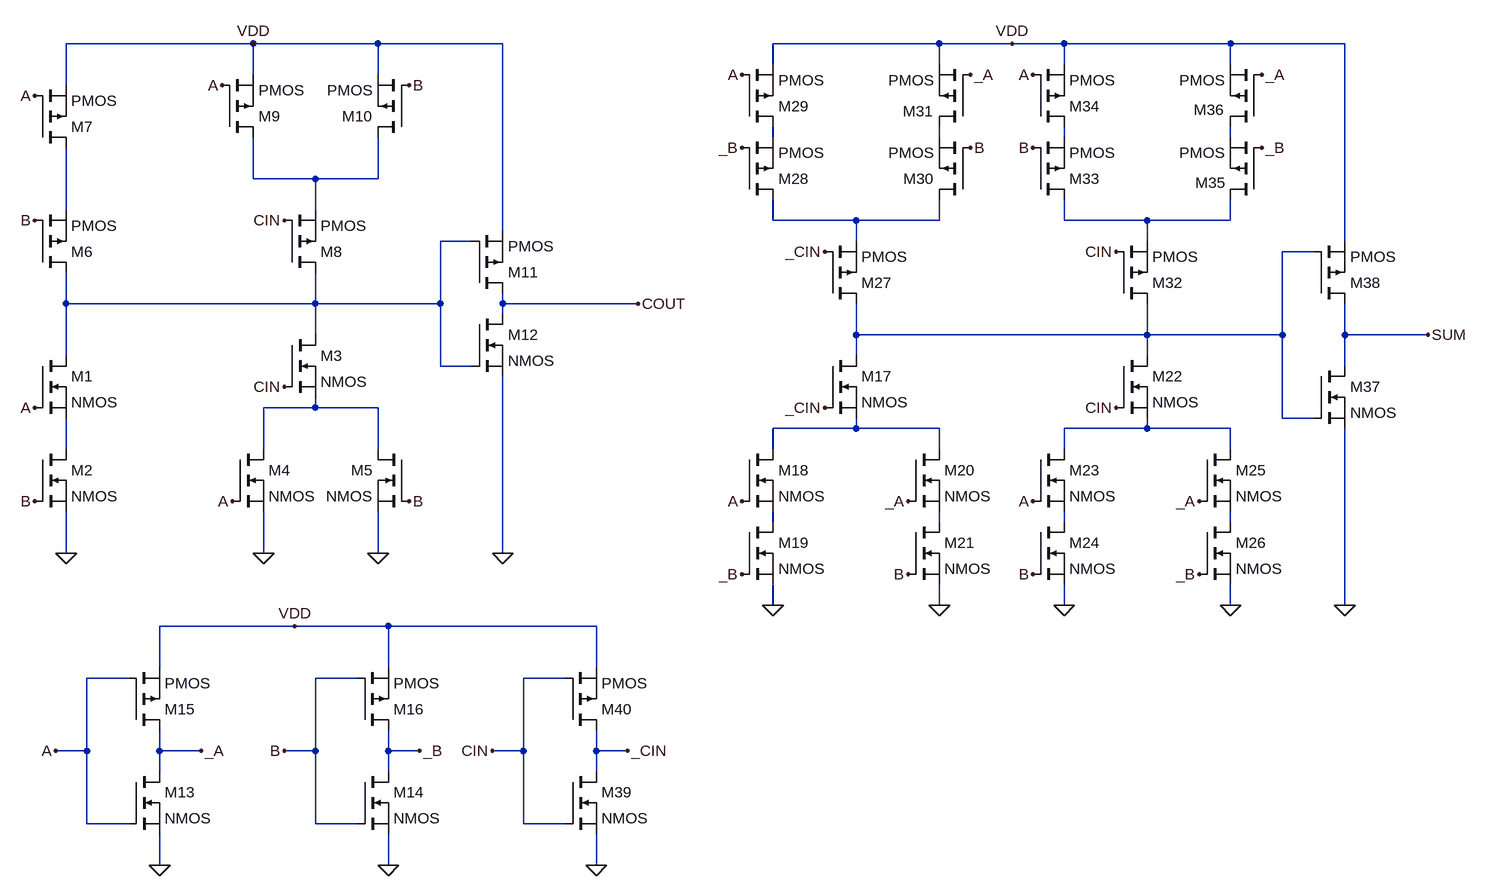
[diagram p0: schematic FA version1.asc]
FA version1.asc, the LTspice schematic file:
Version 4
SHEET 1 2888 1048
WIRE -64 -544 -352 -544
WIRE 128 -544 -64 -544
WIRE 320 -544 128 -544
WIRE 992 -544 736 -544
WIRE 1104 -544 992 -544
WIRE 1184 -544 1104 -544
WIRE 1440 -544 1184 -544
WIRE 1616 -544 1440 -544
WIRE 736 -512 736 -544
WIRE 992 -512 992 -544
WIRE 1184 -512 1184 -544
WIRE 1440 -512 1440 -544
WIRE -64 -496 -64 -544
WIRE 128 -496 128 -544
WIRE -352 -480 -352 -544
WIRE 736 -400 736 -416
WIRE 992 -400 992 -416
WIRE 1184 -400 1184 -416
WIRE 1440 -400 1440 -416
WIRE -64 -336 -64 -400
WIRE 32 -336 -64 -336
WIRE 128 -336 128 -400
WIRE 128 -336 32 -336
WIRE -352 -288 -352 -384
WIRE 32 -288 32 -336
WIRE 736 -272 736 -304
WIRE 864 -272 736 -272
WIRE 992 -272 992 -304
WIRE 992 -272 864 -272
WIRE 1184 -272 1184 -304
WIRE 1312 -272 1184 -272
WIRE 1440 -272 1440 -304
WIRE 1440 -272 1312 -272
WIRE 320 -256 320 -544
WIRE 272 -240 224 -240
WIRE 864 -240 864 -272
WIRE 1312 -240 1312 -272
WIRE 1616 -240 1616 -544
WIRE 1568 -224 1520 -224
WIRE -352 -144 -352 -192
WIRE 32 -144 32 -192
WIRE 32 -144 -352 -144
WIRE 224 -144 224 -240
WIRE 224 -144 32 -144
WIRE 320 -144 320 -160
WIRE 528 -144 320 -144
WIRE 320 -128 320 -144
WIRE 32 -96 32 -144
WIRE 864 -96 864 -144
WIRE 1312 -96 1312 -144
WIRE 1312 -96 864 -96
WIRE 1520 -96 1520 -224
WIRE 1520 -96 1312 -96
WIRE 1616 -96 1616 -144
WIRE 1744 -96 1616 -96
WIRE -352 -64 -352 -144
WIRE 864 -64 864 -96
WIRE 1312 -64 1312 -96
WIRE 224 -48 224 -144
WIRE 272 -48 224 -48
WIRE 1616 -48 1616 -96
WIRE 32 16 32 0
WIRE 32 16 -48 16
WIRE 128 16 32 16
WIRE 1520 32 1520 -96
WIRE 1568 32 1520 32
WIRE 864 48 864 32
WIRE 864 48 736 48
WIRE 992 48 864 48
WIRE 1312 48 1312 32
WIRE 1312 48 1184 48
WIRE 1440 48 1312 48
WIRE -352 80 -352 32
WIRE -48 80 -48 16
WIRE 128 80 128 16
WIRE 736 80 736 48
WIRE 992 80 992 48
WIRE 1184 80 1184 48
WIRE 1440 80 1440 48
WIRE 736 192 736 176
WIRE 992 192 992 176
WIRE 1184 192 1184 176
WIRE 1440 192 1440 176
WIRE -352 240 -352 176
WIRE -48 240 -48 176
WIRE 128 240 128 176
WIRE 320 240 320 -32
WIRE 736 320 736 288
WIRE 992 320 992 288
WIRE 1184 320 1184 288
WIRE 1440 320 1440 288
WIRE 1616 320 1616 48
WIRE 0 352 -208 352
WIRE 144 352 0 352
WIRE 464 352 144 352
WIRE -208 416 -208 352
WIRE 144 416 144 352
WIRE 464 416 464 352
WIRE -256 432 -320 432
WIRE 96 432 32 432
WIRE 416 432 352 432
WIRE -320 544 -320 432
WIRE -320 544 -368 544
WIRE -208 544 -208 512
WIRE -144 544 -208 544
WIRE 32 544 32 432
WIRE 32 544 -16 544
WIRE 144 544 144 512
WIRE 192 544 144 544
WIRE 352 544 352 432
WIRE 352 544 304 544
WIRE 464 544 464 512
WIRE 512 544 464 544
WIRE -208 576 -208 544
WIRE 144 576 144 544
WIRE 464 576 464 544
WIRE -320 656 -320 544
WIRE -256 656 -320 656
WIRE 32 656 32 544
WIRE 96 656 32 656
WIRE 352 656 352 544
WIRE 416 656 352 656
WIRE -208 720 -208 672
WIRE 144 720 144 672
WIRE 464 720 464 672
FLAG -352 240 0
FLAG -48 240 0
FLAG 128 240 0
FLAG -64 -544 VDD
FLAG 320 240 0
FLAG 528 -144 COUT
FLAG 0 352 VDD
FLAG -208 720 0
FLAG 144 720 0
FLAG 736 320 0
FLAG 992 320 0
FLAG 1184 320 0
FLAG 1440 320 0
FLAG 1616 320 0
FLAG 1744 -96 SUM
FLAG 1104 -544 VDD
FLAG 464 720 0
FLAG -400 -464 A
FLAG -112 -480 A
FLAG -400 16 A
FLAG -96 160 A
FLAG -368 544 A
FLAG 688 -496 A
FLAG 1136 -496 A
FLAG 688 160 A
FLAG 1136 160 A
FLAG -144 544 _A
FLAG 1040 -496 _A
FLAG 1488 -496 _A
FLAG 944 160 _A
FLAG 1392 160 _A
FLAG -400 -272 B
FLAG -400 160 B
FLAG 176 -480 B
FLAG 176 160 B
FLAG -16 544 B
FLAG 1040 -384 B
FLAG 1136 -384 B
FLAG 1136 272 B
FLAG 944 272 B
FLAG 192 544 _B
FLAG 688 -384 _B
FLAG 1488 -384 _B
FLAG 1392 272 _B
FLAG 688 272 _B
FLAG 304 544 CIN
FLAG -16 -272 CIN
FLAG -16 -16 CIN
FLAG 1264 -224 CIN
FLAG 1264 16 CIN
FLAG 512 544 _CIN
FLAG 816 -224 _CIN
FLAG 816 16 _CIN
SYMBOL nmos -400 -64 R0
SYMATTR InstName M1
SYMBOL nmos -400 80 R0
SYMATTR InstName M2
SYMBOL nmos -16 -96 R0
SYMATTR InstName M3
SYMBOL nmos -96 80 R0
SYMATTR InstName M4
SYMBOL nmos 176 80 M0
SYMATTR InstName M5
SYMBOL pmos -400 -192 M180
SYMATTR InstName M6
SYMBOL pmos -400 -384 M180
SYMATTR InstName M7
SYMBOL pmos -16 -192 M180
SYMATTR InstName M8
SYMBOL pmos -112 -400 M180
SYMATTR InstName M9
SYMBOL pmos 176 -400 R180
SYMATTR InstName M10
SYMBOL pmos 272 -160 M180
SYMATTR InstName M11
SYMBOL nmos 272 -128 R0
SYMATTR InstName M12
SYMBOL nmos -256 576 R0
SYMATTR InstName M13
SYMBOL nmos 96 576 R0
SYMATTR InstName M14
SYMBOL pmos -256 512 M180
SYMATTR InstName M15
SYMBOL pmos 96 512 M180
SYMATTR InstName M16
SYMBOL nmos 816 -64 R0
SYMATTR InstName M17
SYMBOL nmos 688 80 R0
SYMATTR InstName M18
SYMBOL nmos 688 192 R0
SYMATTR InstName M19
SYMBOL nmos 944 80 R0
SYMATTR InstName M20
SYMBOL nmos 944 192 R0
SYMATTR InstName M21
SYMBOL nmos 1264 -64 R0
SYMATTR InstName M22
SYMBOL nmos 1136 80 R0
SYMATTR InstName M23
SYMBOL nmos 1136 192 R0
SYMATTR InstName M24
SYMBOL nmos 1392 80 R0
SYMATTR InstName M25
SYMBOL nmos 1392 192 R0
SYMATTR InstName M26
SYMBOL pmos 816 -144 M180
SYMATTR InstName M27
SYMBOL pmos 688 -304 M180
SYMATTR InstName M28
SYMBOL pmos 688 -416 M180
SYMATTR InstName M29
SYMBOL pmos 1040 -304 R180
SYMATTR InstName M30
SYMBOL pmos 1040 -416 R180
WINDOW 0 57 24 Left 2
SYMATTR InstName M31
SYMBOL pmos 1264 -144 M180
SYMATTR InstName M32
SYMBOL pmos 1136 -304 M180
SYMATTR InstName M33
SYMBOL pmos 1136 -416 M180
SYMATTR InstName M34
SYMBOL pmos 1488 -304 R180
WINDOW 0 55 26 Left 2
SYMATTR InstName M35
SYMBOL pmos 1488 -416 R180
WINDOW 0 57 26 Left 2
SYMATTR InstName M36
SYMBOL pmos 1568 -144 M180
SYMATTR InstName M38
SYMBOL nmos 1568 -48 R0
SYMATTR InstName M37
SYMBOL nmos 416 576 R0
SYMATTR InstName M39
SYMBOL pmos 416 512 M180
SYMATTR InstName M40

The netlist it stands for:
* FA version1.asc
M1 N009 A N014 N014 NMOS
M2 N014 B 0 0 NMOS
M3 N009 CIN N011 N011 NMOS
M4 N011 A 0 0 NMOS
M5 N011 B 0 0 NMOS
M6 N009 B N006 N006 PMOS
M7 N006 A VDD VDD PMOS
M8 N009 CIN N005 N005 PMOS
M9 N005 A VDD VDD PMOS
M10 N005 B VDD VDD PMOS
M11 COUT N009 VDD VDD PMOS
M12 COUT N009 0 0 NMOS
M13 _A A 0 0 NMOS
M14 _B B 0 0 NMOS
M15 _A A VDD VDD PMOS
M16 _B B VDD VDD PMOS
M17 N010 _CIN N012 N012 NMOS
M18 N012 A N015 N015 NMOS
M19 N015 _B 0 0 NMOS
M20 N012 _A N016 N016 NMOS
M21 N016 B 0 0 NMOS
M22 N010 CIN N013 N013 NMOS
M23 N013 A N017 N017 NMOS
M24 N017 B 0 0 NMOS
M25 N013 _A N018 N018 NMOS
M26 N018 _B 0 0 NMOS
M27 N010 _CIN N007 N007 PMOS
M28 N007 _B N001 N001 PMOS
M29 N001 A VDD VDD PMOS
M30 N007 B N002 N002 PMOS
M31 N002 _A VDD VDD PMOS
M32 N010 CIN N008 N008 PMOS
M33 N008 B N003 N003 PMOS
M34 N003 A VDD VDD PMOS
M35 N008 _B N004 N004 PMOS
M36 N004 _A VDD VDD PMOS
M38 SUM N010 VDD VDD PMOS
M37 SUM N010 0 0 NMOS
M39 _CIN CIN 0 0 NMOS
M40 _CIN CIN VDD VDD PMOS
.model NMOS NMOS
.model PMOS PMOS
.lib standard.mos
.backanno
.end